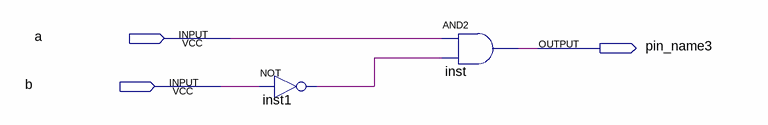
[diagram p0: schematic sheet]
// Quartus schematic bitmaior.bdf as structural Verilog: 2 symbols, 3 pins
module bitmaior (
  input  a,
  input  b,
  output pin_name3
);

  wire inst1_out;

  not inst1 (inst1_out, b);
  and inst (pin_name3, a, inst1_out);
endmodule
